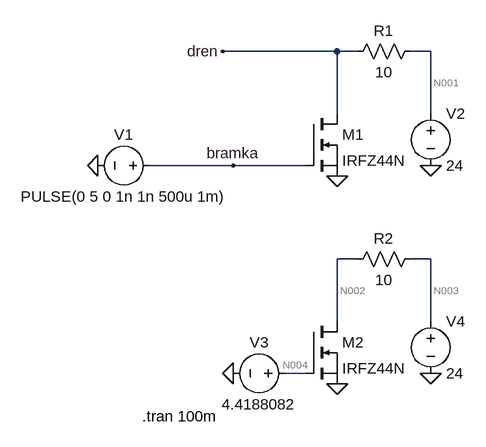
[diagram p0: schematic zad2a.asc]
zad2a.asc, the LTspice schematic file:
Version 4
SHEET 1 880 680
WIRE 272 -16 96 -16
WIRE 304 -16 272 -16
WIRE 416 -16 384 -16
WIRE 272 80 272 -16
WIRE 416 80 416 -16
WIRE 112 160 -16 160
WIRE 224 160 112 160
WIRE 304 304 272 304
WIRE 416 304 384 304
WIRE 272 400 272 304
WIRE 416 400 416 304
WIRE 224 480 192 480
FLAG -96 160 0
FLAG 416 160 0
FLAG 272 176 0
FLAG 112 480 0
FLAG 416 480 0
FLAG 272 496 0
FLAG 112 160 bramka
FLAG 96 -16 dren
SYMBOL nmos 224 80 R0
SYMATTR InstName M1
SYMATTR Value IRFZ44N
SYMBOL voltage 0 160 R90
WINDOW 0 -32 56 VBottom 2
WINDOW 3 32 56 VTop 2
WINDOW 123 0 0 Left 0
WINDOW 39 0 0 Left 0
SYMATTR InstName V1
SYMATTR Value PULSE(0 5 0 1n 1n 500u 1m)
SYMBOL voltage 416 64 R0
SYMATTR InstName V2
SYMATTR Value 24
SYMBOL res 400 -32 R90
WINDOW 0 0 56 VBottom 2
WINDOW 3 32 56 VTop 2
SYMATTR InstName R1
SYMATTR Value 10
SYMBOL nmos 224 400 R0
SYMATTR InstName M2
SYMATTR Value IRFZ44N
SYMBOL voltage 208 480 R90
WINDOW 0 -32 56 VBottom 2
WINDOW 3 32 56 VTop 2
WINDOW 123 0 0 Left 0
WINDOW 39 0 0 Left 0
SYMATTR InstName V3
SYMATTR Value 4.4188082
SYMBOL voltage 416 384 R0
SYMATTR InstName V4
SYMATTR Value 24
SYMBOL res 400 288 R90
WINDOW 0 0 56 VBottom 2
WINDOW 3 32 56 VTop 2
SYMATTR InstName R2
SYMATTR Value 10
TEXT -28 546 Left 2 !.tran 100m

The netlist it stands for:
* zad2a.asc
M1 dren bramka 0 0 IRFZ44N
V1 bramka 0 PULSE(0 5 0 1n 1n 500u 1m)
V2 N001 0 24
R1 N001 dren 10
M2 N002 N004 0 0 IRFZ44N
V3 N004 0 4.4188082
V4 N003 0 24
R2 N003 N002 10
.model NMOS NMOS
.model PMOS PMOS
.lib standard.mos
.tran 100m
.backanno
.end

* Results of the author's LTspice run, read from the files saved beside the schematic
* Operating Point, zero values left out:
*   V(dren) = 24 V
*   V(n001) = 24 V
*   V(n002) = 7.217 V
*   V(n004) = 4.419 V
*   V(n003) = 24 V
*   Id(M1) = 25.6 pA
*   Is(M1) = -25.6 pA
*   Id(M2) = 1.678 A
*   Is(M2) = -1.678 A
*   I(R1) = 48.43 pA
*   I(R2) = 1.678 A
*   I(V2) = -48.43 pA
*   I(V4) = -1.678 A
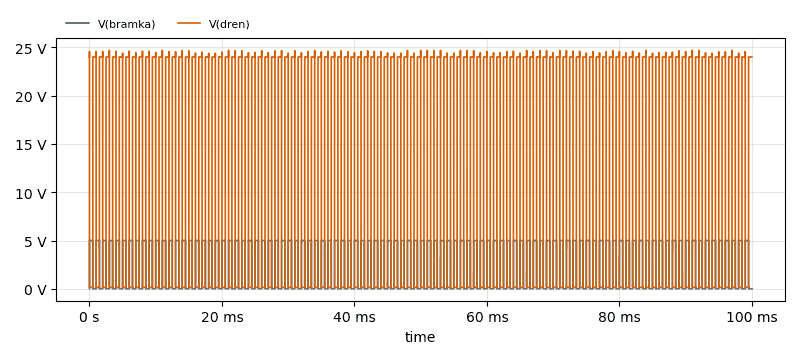
[diagram p1: Transient Analysis of zad2a.asc, plotted from the saved traces]
* Transient Analysis, 1 run:
*   V(bramka): min 0 V, max 5 V, average 2.5 V, rms 3.536 V, last 0 V
*   V(dren): min 105.6 mV, max 24.69 V, average 12.07 V, rms 16.97 V, last 24 V